# Altium schematic sheet Command.SchDoc
size A
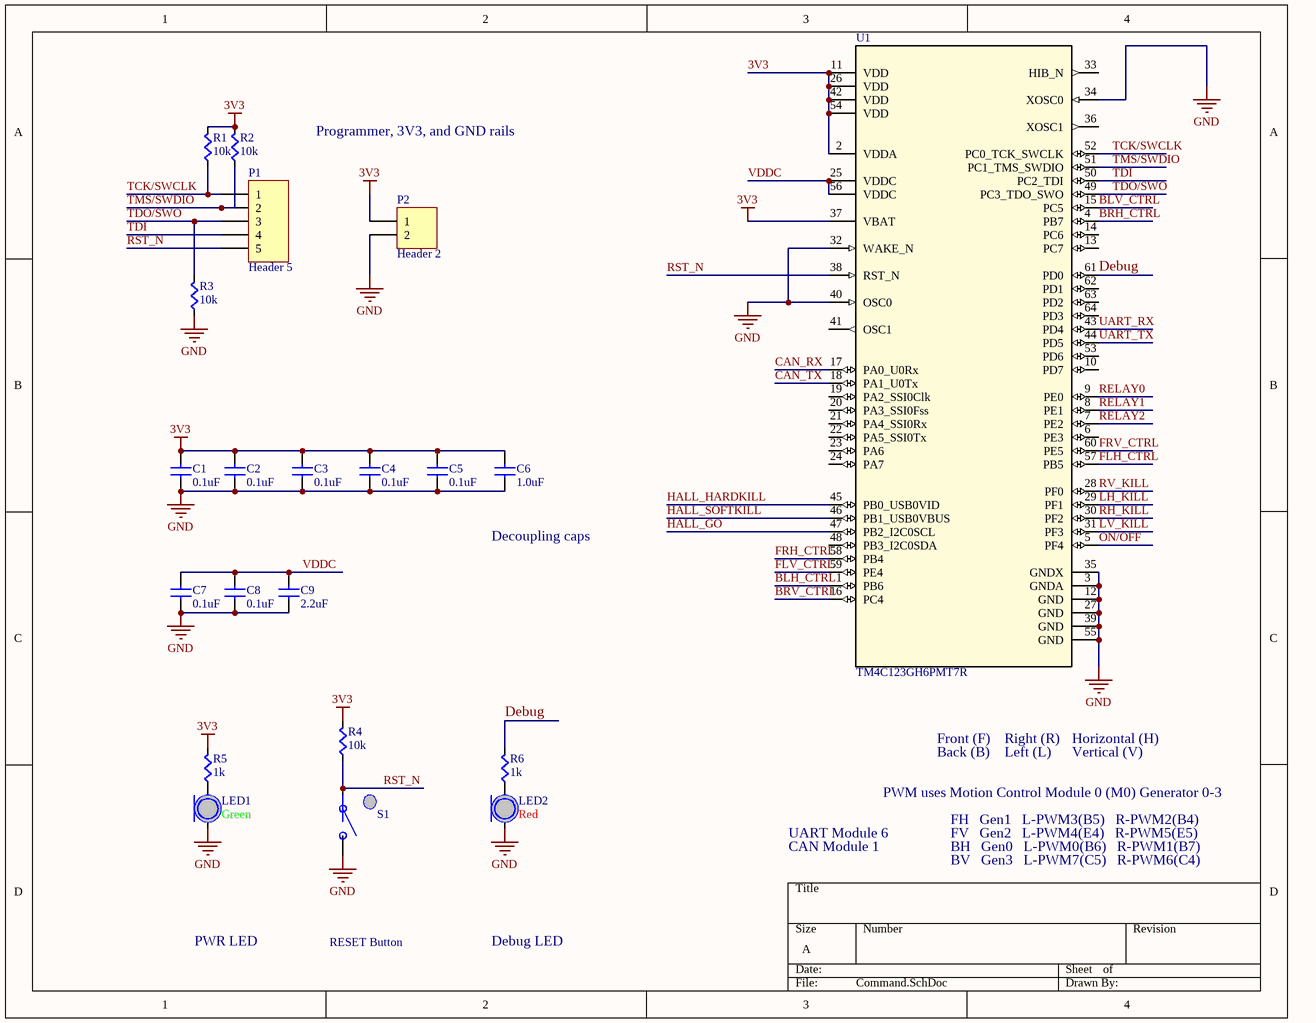
[diagram p0: Command.SchDoc]

## Parts
C1  value 0.1uF  [CAPC0603]  (hidden comment: Cap)
C2  value 0.1uF  [CAPC0603]  (hidden comment: Cap)
C3  value 0.1uF  [CAPC0603]  (hidden comment: Cap)
C4  value 0.1uF  [CAPC0603]  (hidden comment: Cap)
C5  value 0.1uF  [CAPC0603]  (hidden comment: Cap)
C6  value 1.0uF  [CAPC0603]  (hidden comment: Cap)
C7  value 0.1uF  [CAPC0603]  (hidden comment: Cap)
C8  value 0.1uF  [CAPC0603]  (hidden comment: Cap)
C9  value 2.2uF  [CAPC0603]  (hidden comment: Cap)
LED1  Color: Green  [LED0603]  (hidden comment: LED)
LED2  Color: Red  [LED0603]  (hidden comment: LED)
P1  Header 5  [HDR1X5]
P2  Header 2  [HDR1X2]
R1  value 10k  [RES0603]  (hidden comment: Res)
R2  value 10k  [RES0603]  (hidden comment: Res)
R3  value 10k  [RES0603]  (hidden comment: Res)
R4  value 10k  [RES0603]  (hidden comment: Res)
R5  value 1k  [RES0603]  (hidden comment: Res)
R6  value 1k  [RES0603]  (hidden comment: Res)
S1  Button  [PTS645xxxxSMTR92]  (value not drawn)
U1  TM4C123GH6PMT7R  [TM4C123GH6PMT7R_M]

## Nets
3V3: C1.1(A) C2.1(A) C3.1(A) C4.1(A) C5.1(A) C6.1(A) P2.1 R1.1(A) R2.1(A) R4.1(A) R5.1(A) U1.2(VDDA) U1.11(VDD) U1.26(VDD) U1.37(VBAT) U1.42(VDD) U1.54(VDD)
GND: C1.2(B) C2.2(B) C3.2(B) C4.2(B) C5.2(B) C6.2(B) C7.2(B) C8.2(B) C9.2(B) LED1.C LED2.C P2.2 R3.2(B) S1.B U1.3(GNDA) U1.12(GND) U1.27(GND) U1.32(WAKE_N) U1.34(XOSC0) U1.35(GNDX) U1.39(GND) U1.40(OSC0) U1.55(GND)
BLH_CTRL: U1.1(PB6)
BLV_CTRL: U1.15(PC5)
BRH_CTRL: U1.4(PB7)
BRV_CTRL: U1.16(PC4)
CAN_RX: U1.17(PA0_U0Rx)
CAN_TX: U1.18(PA1_U0Tx)
Debug: R6.1(A) U1.61(PD0)
FLH_CTRL: U1.57(PB5)
FLV_CTRL: U1.59(PE4)
FRH_CTRL: U1.58(PB4)
FRV_CTRL: U1.60(PE5)
HALL_GO: U1.47(PB2_I2C0SCL)
HALL_HARDKILL: U1.45(PB0_USB0VID)
HALL_SOFTKILL: U1.46(PB1_USB0VBUS)
LH_KILL: U1.29(PF1)
LV_KILL: U1.31(PF3)
ON/OFF: U1.5(PF4)
RELAY0: U1.9(PE0)
RELAY1: U1.8(PE1)
RELAY2: U1.7(PE2)
RH_KILL: U1.30(PF2)
RST_N: P1.5 R4.2(B) S1.A U1.38(RST_N)
RV_KILL: U1.28(PF0)
TCK/SWCLK: P1.1 R1.2(B) U1.52(PC0_TCK_SWCLK)
TDI: P1.4 U1.50(PC2_TDI)
TDO/SWO: P1.3 R3.1(A) U1.49(PC3_TDO_SWO)
TMS/SWDIO: P1.2 R2.2(B) U1.51(PC1_TMS_SWDIO)
UART_RX: U1.43(PD4)
UART_TX: U1.44(PD5)
VDDC: C7.1(A) C8.1(A) C9.1(A) U1.25(VDDC) U1.56(VDDC)
NetLED1_A: LED1.A R5.2(B)
NetLED2_A: LED2.A R6.2(B)

Not connected (* = marked no-connect by the designer): U1 6(PE3) 10(PD7) 13(PC7) 14(PC6) 19(PA2_SSI0Clk) 20(PA3_SSI0Fss) 21(PA4_SSI0Rx) 22(PA5_SSI0Tx) 23(PA6) 24(PA7) 33(HIB_N) 36(XOSC1) 41(OSC1) 48(PB3_I2C0SDA) 53(PD6) 62(PD1) 63(PD2) 64(PD3)

## Notes on the sheet
- Programmer, 3V3, and GND rails
- Decoupling caps
- Front (F)
- Back (B)
- Right (R)
- Left (L)
- Horizontal (H)
- Vertical (V)
- UART Module 6
- PWM uses Motion Control Module 0 (M0) Generator 0-3
- FH   Gen1   L-PWM3(B5)   R-PWM2(B4)
- FV   Gen2   L-PWM4(E4)   R-PWM5(E5)
- CAN Module 1
- BH   Gen0   L-PWM0(B6)   R-PWM1(B7)
- BV   Gen3   L-PWM7(C5)   R-PWM6(C4)
- PWR LED
- RESET Button
- Debug LED

## Library data of the parts
P1 = Header 5: Header, 5-Pin; LatestRevisionDate: 17-Jul-2002; LatestRevisionNote: Re-released for DXP Platform.; Publisher: Altium Limited
P2 = Header 2: Header, 2-Pin; LatestRevisionDate: 17-Jul-2002; LatestRevisionNote: Re-released for DXP Platform.; Publisher: Altium Limited
S1 = Button: SPST Button; Supplier 1: Digi-Key; Supplier Part Number 1: CKN9087CT-ND
U1 = TM4C123GH6PMT7R: Imported; PartNumber: TM4C123GH6PMTR; Manufacturer: Texas Instruments; CompType: IC; PIN_COUNT: 64; Application_BuildNumber: *; Alternate_PartNumber: TM4C123GH6PMT; PackageReference: PM0064A; MountType: SMT; RoHS: Y; RefDes: RefDes; TYPE: TYPE; Value: Value
C1-C9 = Cap: Supplier 1: Digi-Key; Supplier Part Number 1: 1276-1000-1-ND
LED1 LED2 = LED: Supplier 1: Digi-Key; Supplier Part Number 1: 754-1122-1-ND
R1-R6 = Res: Supplier 1: Digi-Key; Supplier Part Number 1: RMCF0603JT10K0CT-ND